# Altium schematic sheet mcu_f103.SchDoc
size A4; SheetNumber: 7; SheetTotal: 7
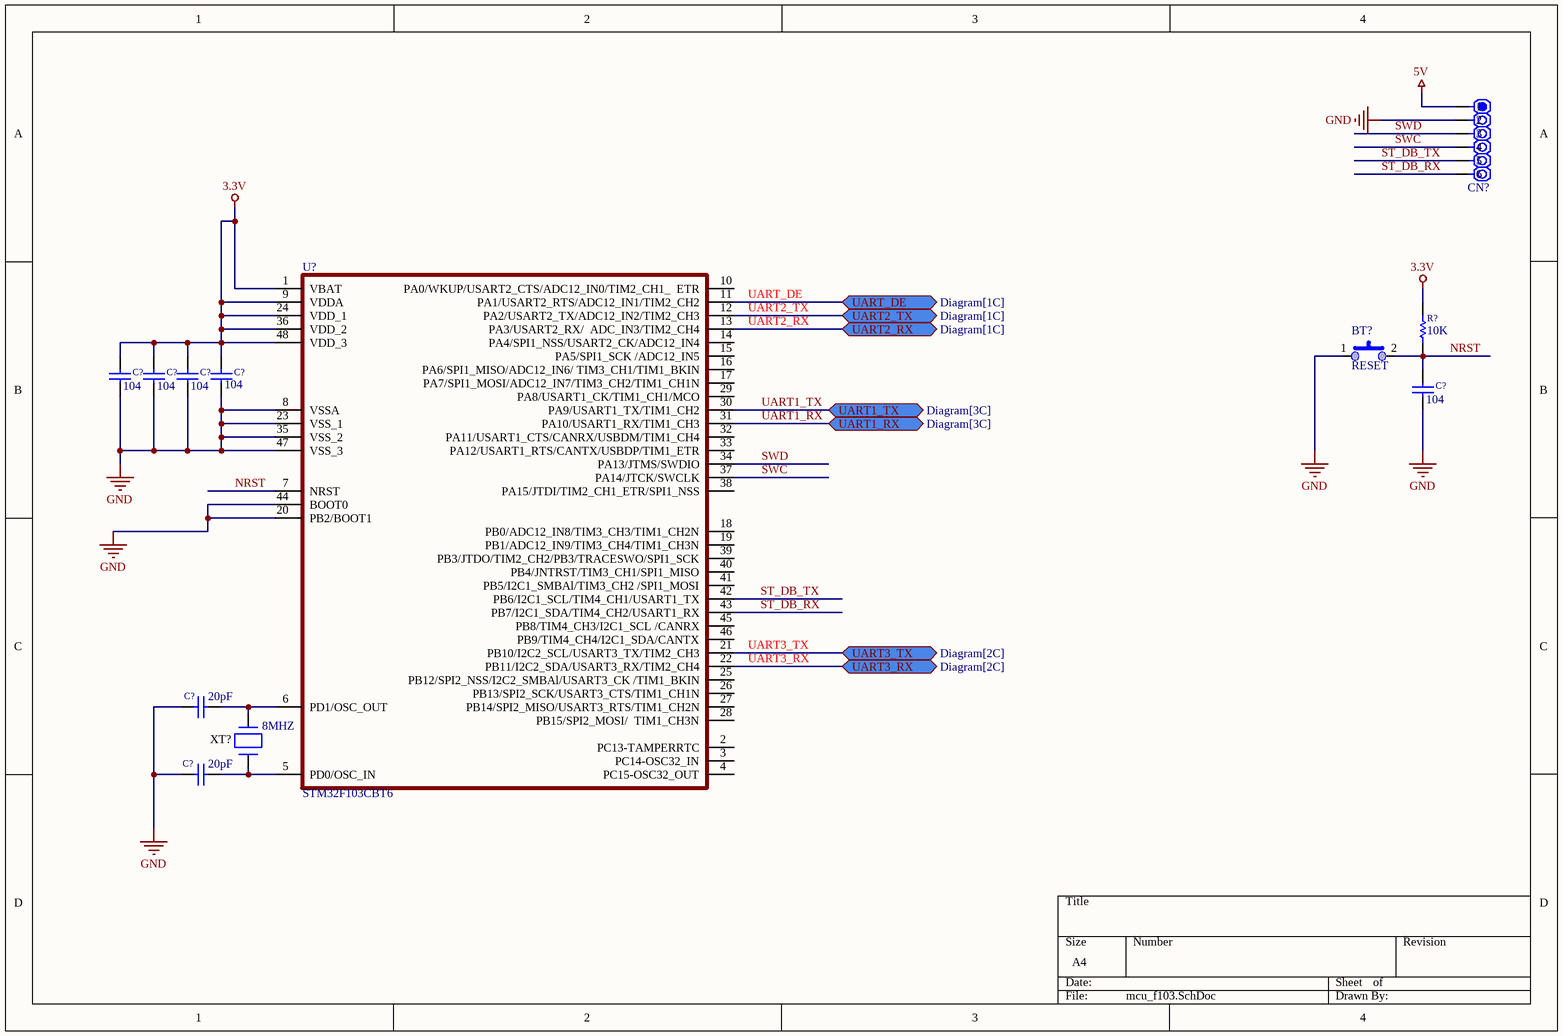
[diagram p0: mcu_f103.SchDoc]

## Parts
(Parts that share a designator on the sheet are numbered #1, #2 ... from top to bottom, then left to right.)
BT?  RESET  [B3U-1000P]
C?#1  104  [C2012-0805]
C?#2  104  [C2012-0805]
C?#3  104  [C2012-0805]
C?#4  104  [C2012-0805]
C?#5  104  [C2012-0805]
C?#6  20pF  [C2012-0805]
C?#7  20pF  [C2012-0805]
CN?  DEBUG  [CON.HD1X6H]  (value not drawn)
R?  10K  [R2012-0805]
U?  STM32F103CBT6  [LQFP_48]
XT?  8MHz  [Cry-5032]

## Ports
UART1_RX (bidir, see Diagram[3C]), UART1_TX (bidir, see Diagram[3C]), UART2_RX (bidir, see Diagram[1C]), UART2_TX (bidir, see Diagram[1C]), UART3_RX (bidir, see Diagram[2C]), UART3_TX (bidir, see Diagram[2C]), UART_DE (bidir, see Diagram[1C])

## Nets
3.3V: C?#1.1 C?#2.1 C?#3.1 C?#4.1 R?.1 U?.1(VBAT) U?.9(VDDA) U?.24(VDD_1) U?.36(VDD_2) U?.48(VDD_3)
5V: CN?.1
GND: BT?.1 C?#1.2 C?#2.2 C?#3.2 C?#4.2 C?#5.2 C?#6.1 C?#7.1 CN?.2 U?.8(VSSA) U?.20(PB2/BOOT1) U?.23(VSS_1) U?.35(VSS_2) U?.44(BOOT0) U?.47(VSS_3)
NRST: BT?.2 C?#5.1 R?.2 U?.7(NRST)
ST_DB_RX: CN?.6 U?.43(PB7/I2C1_SDA/TIM4_CH2/USART1_RX)
ST_DB_TX: CN?.5 U?.42(PB6/I2C1_SCL/TIM4_CH1/USART1_TX)
SWC: CN?.4 U?.37(PA14/JTCK/SWCLK)
SWD: CN?.3 U?.34(PA13/JTMS/SWDIO)
UART1_RX: U?.31(PA10/USART1_RX/TIM1_CH3) ; port UART1_RX
UART1_TX: U?.30(PA9/USART1_TX/TIM1_CH2) ; port UART1_TX
UART2_RX: U?.13(PA3/USART2_RX/__ADC_IN3/TIM2_CH4) ; port UART2_RX
UART2_TX: U?.12(PA2/USART2_TX/ADC12_IN2/TIM2_CH3) ; port UART2_TX
UART3_RX: U?.22(PB11/I2C2_SDA/USART3_RX/TIM2_CH4) ; port UART3_RX
UART3_TX: U?.21(PB10/I2C2_SCL/USART3_TX/TIM2_CH3) ; port UART3_TX
UART_DE: U?.11(PA1/USART2_RTS/ADC12_IN1/TIM2_CH2) ; port UART_DE
NetC?#6_2: C?#6.2 U?.6(PD1/OSC_OUT) XT?.2
NetC?#7_2: C?#7.2 U?.5(PD0/OSC_IN) XT?.1

Not connected (* = marked no-connect by the designer): U? 2(PC13-TAMPERRTC) 3(PC14-OSC32_IN) 4(PC15-OSC32_OUT) 10(PA0/WKUP/USART2_CTS/ADC12_IN0/TIM2_CH1___ETR) 14(PA4/SPI1_NSS/USART2_CK/ADC12_IN4) 15(PA5/SPI1_SCK_/ADC12_IN5) 16(PA6/SPI1_MISO/ADC12_IN6/_TIM3_CH1/TIM1_BKIN) 17(PA7/SPI1_MOSI/ADC12_IN7/TIM3_CH2/TIM1_CH1N) 18(PB0/ADC12_IN8/TIM3_CH3/TIM1_CH2N) 19(PB1/ADC12_IN9/TIM3_CH4/TIM1_CH3N) 25(PB12/SPI2_NSS/I2C2_SMBAl/USART3_CK_/TIM1_BKIN) 26(PB13/SPI2_SCK/USART3_CTS/TIM1_CH1N) 27(PB14/SPI2_MISO/USART3_RTS/TIM1_CH2N) 28(PB15/SPI2_MOSI/__TIM1_CH3N) 29(PA8/USART1_CK/TIM1_CH1/MCO) 32(PA11/USART1_CTS/CANRX/USBDM/TIM1_CH4) 33(PA12/USART1_RTS/CANTX/USBDP/TIM1_ETR) 38(PA15/JTDI/TIM2_CH1_ETR/SPI1_NSS) 39(PB3/JTDO/TIM2_CH2/PB3/TRACESWO/SPI1_SCK) 40(PB4/JNTRST/TIM3_CH1/SPI1_MISO) 41(PB5/I2C1_SMBAl/TIM3_CH2_/SPI1_MOSI) 45(PB8/TIM4_CH3/I2C1_SCL_/CANRX) 46(PB9/TIM4_CH4/I2C1_SDA/CANTX)

## Library data of the parts
BT? = Button_2p
C?#1-C?#7 = Cap <SMD>: Capacitor; AEMS Code: 2100341; Vendor: Digikey; Volt: 16V; Published: 13-April-2009; Publisher: Hoang Nguyen; ComponentLink1Description: Digikey Part Link; ComponentLink2Description: Open Datasheet; ComponentLink2URL: H:\LIBRARY\LIBRARY.Datasheet\
  C?#1-C?#5: Value: 104
  C?#6 C?#7: Value: 20pF
CN? = CON.HDR1x6: Header 1x5; Publisher: Hoang Nguyen; ComponentLink1Description: Digikey Part link; ComponentLink2Description: Open DataSheet; ComponentLink2URL: H:\LIBRARY\LIBRARY.Datasheet\
R? = Resistor <SMD>: Resistor; AEMS Code: 1200430; Vendor: Digikey; Tollerance: 5%; Published: 17-3-2009; Publisher: Hoang Nguyen; ComponentLink1Description: Digikey Part Link; ComponentLink2Description: Open Datasheet; ComponentLink2URL: H:\LIBRARY\LIBRARY.Datasheet\; Value: 10K
U? = STM32F103C8T6_cus: STM32F103C8T6
XT? = Crystal: Vendor: Digikey; Published: 13-April-2009; Publisher: Hoang Nguyen; ComponentLink1Description: Digikey Part Link; ComponentLink2Description: Open Datasheet; ComponentLink2URL: H:\LIBRARY\LIBRARY.Datasheet\; Price: 2000 VND; Value: 8MHZ